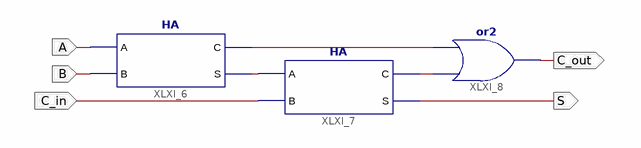
[diagram p0: schematic sheet 1]
// Xilinx ISE schematic FA.sch (spartan3e) as structural Verilog: 3 symbols, 5 ports
module FA (
  input  C_in,
  input  A,
  input  B,
  output S,
  output C_out
);

  wire XLXN_22, XLXN_23, XLXN_24;

  HA XLXI_6 (.A(A), .B(B), .C(XLXN_24), .S(XLXN_23));
  HA XLXI_7 (.A(XLXN_23), .B(C_in), .C(XLXN_22), .S(S));
  or XLXI_8 (C_out, XLXN_22, XLXN_24);
endmodule
